# EAGLE design mega_pin_out_sides (EAGLE 7.3.0)
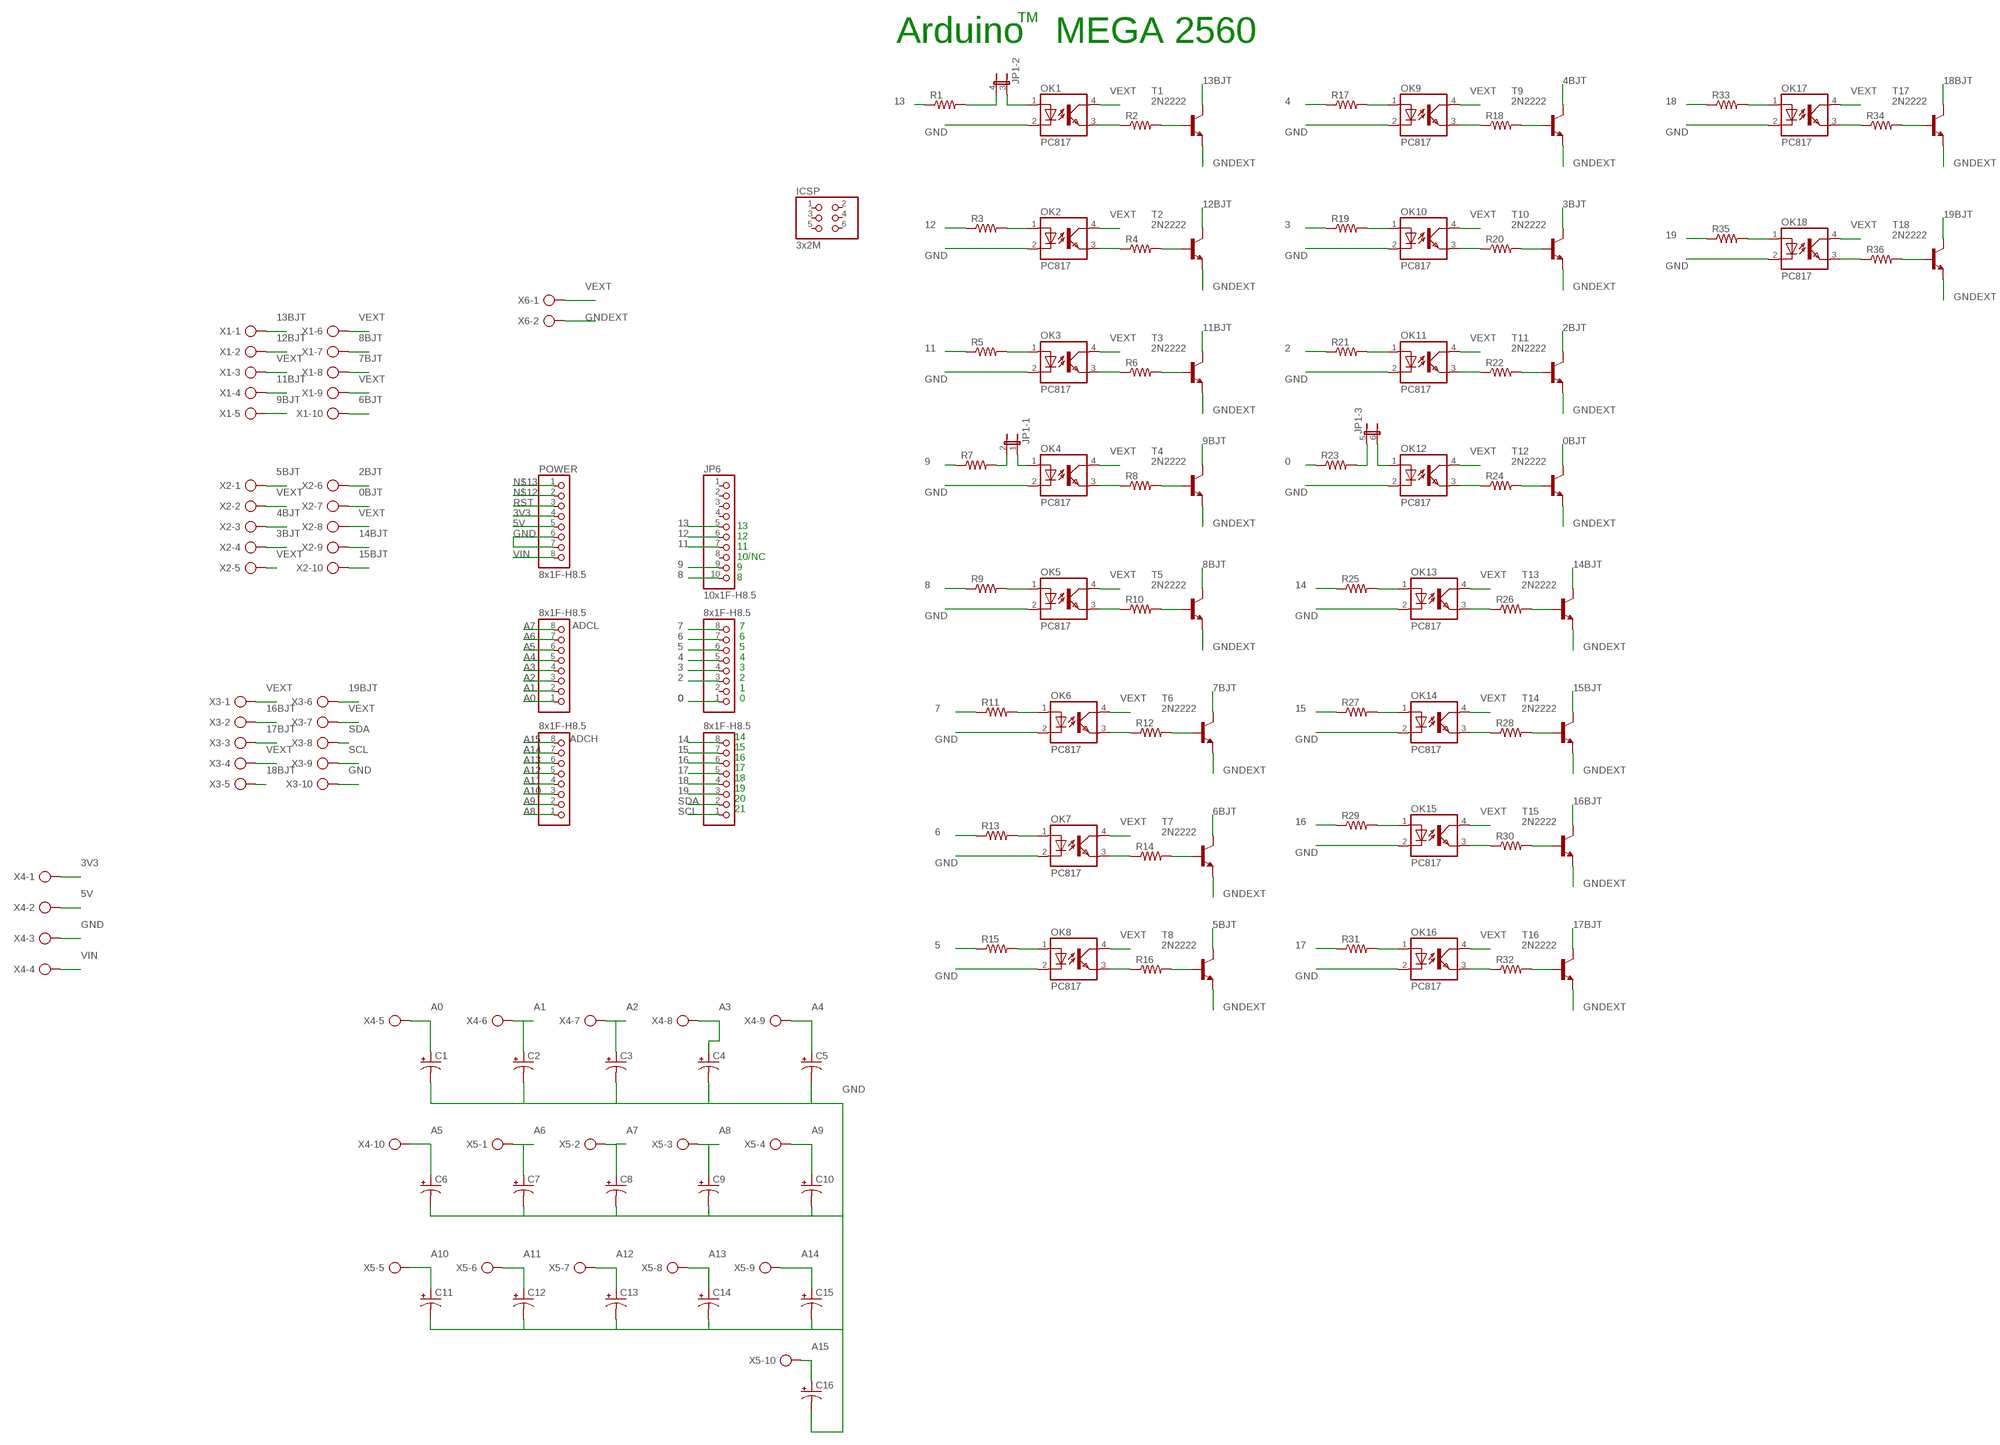
[diagram p0: schematic, sheet 1]

## Parts
ADCH  8x1F-H8.5  PINHD-1X8  [1X08]
ADCL  8x1F-H8.5  PINHD-1X8  [1X08]
C1  CPOL-USE2-4  [E2-4]
C2  CPOL-USE2-4  [E2-4]
C3  CPOL-USE2-4  [E2-4]
C4  CPOL-USE2-4  [E2-4]
C5  CPOL-USE2-4  [E2-4]
C6  CPOL-USE2-4  [E2-4]
C7  CPOL-USE2-4  [E2-4]
C8  CPOL-USE2-4  [E2-4]
C9  CPOL-USE2-4  [E2-4]
C10  CPOL-USE2-4  [E2-4]
C11  CPOL-USE2-4  [E2-4]
C12  CPOL-USE2-4  [E2-4]
C13  CPOL-USE2-4  [E2-4]
C14  CPOL-USE2-4  [E2-4]
C15  CPOL-USE2-4  [E2-4]
C16  CPOL-USE2-4  [E2-4]
COMMUNICATION  8x1F-H8.5  PINHD-1X8  [1X08]
ICSP  3x2M  PINHD-2X3  [2X03]
JP1  JP3QE  [JP3Q]
JP6  10x1F-H8.5  PINHD-1X10_ARD  [1X10]
OK1  PC817  [DIL04]
OK2  PC817  [DIL04]
OK3  PC817  [DIL04]
OK4  PC817  [DIL04]
OK5  PC817  [DIL04]
OK6  PC817  [DIL04]
OK7  PC817  [DIL04]
OK8  PC817  [DIL04]
OK9  PC817  [DIL04]
OK10  PC817  [DIL04]
OK11  PC817  [DIL04]
OK12  PC817  [DIL04]
OK13  PC817  [DIL04]
OK14  PC817  [DIL04]
OK15  PC817  [DIL04]
OK16  PC817  [DIL04]
OK17  PC817  [DIL04]
OK18  PC817  [DIL04]
POWER  8x1F-H8.5  PINHD-1X8  [1X08]
PWML  8x1F-H8.5  PINHD-1X8  [1X08]
R1  R-US_M1206  [M1206]
R2  R-US_M1206  [M1206]
R3  R-US_M1206  [M1206]
R4  R-US_M1206  [M1206]
R5  R-US_M1206  [M1206]
R6  R-US_M1206  [M1206]
R7  R-US_M1206  [M1206]
R8  R-US_M1206  [M1206]
R9  R-US_M1206  [M1206]
R10  R-US_M1206  [M1206]
R11  R-US_M1206  [M1206]
R12  R-US_M1206  [M1206]
R13  R-US_M1206  [M1206]
R14  R-US_M1206  [M1206]
R15  R-US_M1206  [M1206]
R16  R-US_M1206  [M1206]
R17  R-US_M1206  [M1206]
R18  R-US_M1206  [M1206]
R19  R-US_M1206  [M1206]
R20  R-US_M1206  [M1206]
R21  R-US_M1206  [M1206]
R22  R-US_M1206  [M1206]
R23  R-US_M1206  [M1206]
R24  R-US_M1206  [M1206]
R25  R-US_M1206  [M1206]
R26  R-US_M1206  [M1206]
R27  R-US_M1206  [M1206]
R28  R-US_M1206  [M1206]
R29  R-US_M1206  [M1206]
R30  R-US_M1206  [M1206]
R31  R-US_M1206  [M1206]
R32  R-US_M1206  [M1206]
R33  R-US_M1206  [M1206]
R34  R-US_M1206  [M1206]
R35  R-US_M1206  [M1206]
R36  R-US_M1206  [M1206]
T1  2N2222  [TO18]
T2  2N2222  [TO18]
T3  2N2222  [TO18]
T4  2N2222  [TO18]
T5  2N2222  [TO18]
T6  2N2222  [TO18]
T7  2N2222  [TO18]
T8  2N2222  [TO18]
T9  2N2222  [TO18]
T10  2N2222  [TO18]
T11  2N2222  [TO18]
T12  2N2222  [TO18]
T13  2N2222  [TO18]
T14  2N2222  [TO18]
T15  2N2222  [TO18]
T16  2N2222  [TO18]
T17  2N2222  [TO18]
T18  2N2222  [TO18]
X1  AK500/10  [AK500/10]
X2  AK500/10  [AK500/10]
X3  AK500/10  [AK500/10]
X4  AK500/10  [AK500/10]
X5  AK500/10  [AK500/10]
X6  AK500/2  [AK500/2]

## Nets
0: PWML.1 R23.1
0BJT: T12.3(C) X2.7
2: PWML.3 R21.1
2BJT: T11.3(C) X2.6
3: PWML.4 R19.1
3BJT: T10.3(C) X2.4
3V3: POWER.4 X4.1
4: PWML.5 R17.1
4BJT: T9.3(C) X2.3
5: PWML.6 R15.1
5BJT: T8.3(C) X2.1
5V: POWER.5 X4.2
6: PWML.7 R13.1
6BJT: T7.3(C) X1.10
7: PWML.8 R11.1
7BJT: T6.3(C) X1.8
8: JP6.10 R9.1
8BJT: T5.3(C) X1.7
9: JP6.9 R7.1
9BJT: T4.3(C) X1.5
11: JP6.7 R5.1
11BJT: T3.3(C) X1.4
12: JP6.6 R3.1
12BJT: T2.3(C) X1.2
13: JP6.5 R1.1
13BJT: T1.3(C) X1.1
14: COMMUNICATION.8 R25.1
14BJT: T13.3(C) X2.9
15: COMMUNICATION.7 R27.1
15BJT: T14.3(C) X2.10
16: COMMUNICATION.6 R29.1
16BJT: T15.3(C) X3.2
17: COMMUNICATION.5 R31.1
17BJT: T16.3(C) X3.3
18: COMMUNICATION.4 R33.1
18BJT: T17.3(C) X3.5
19: COMMUNICATION.3 R35.1
19BJT: T18.3(C) X3.6
A0: ADCL.1 C1.+ X4.5
A1: ADCL.2 C2.+ X4.6
A2: ADCL.3 C3.+ X4.7
A3: ADCL.4 C4.+ X4.8
A4: ADCL.5 C5.+ X4.9
A5: ADCL.6 C6.+ X4.10
A6: ADCL.7 C7.+ X5.1
A7: ADCL.8 C8.+ X5.2
A8: ADCH.1 C9.+ X5.3
A9: ADCH.2 C10.+ X5.4
A10: ADCH.3 C11.+ X5.5
A11: ADCH.4 C12.+ X5.6
A12: ADCH.5 C13.+ X5.7
A13: ADCH.6 C14.+ X5.8
A14: ADCH.7 C15.+ X5.9
A15: ADCH.8 C16.+ X5.10
GND: C1.- C2.- C3.- C4.- C5.- C6.- C7.- C8.- C9.- C10.- C11.- C12.- C13.- C14.- C15.- C16.- OK1.2(C) OK2.2(C) OK3.2(C) OK4.2(C) OK5.2(C) OK6.2(C) OK7.2(C) OK8.2(C) OK9.2(C) OK10.2(C) OK11.2(C) OK12.2(C) OK13.2(C) OK14.2(C) OK15.2(C) OK16.2(C) OK17.2(C) OK18.2(C) POWER.6 POWER.7 X3.10 X4.3
GNDEXT: T1.1(E) T2.1(E) T3.1(E) T4.1(E) T5.1(E) T6.1(E) T7.1(E) T8.1(E) T9.1(E) T10.1(E) T11.1(E) T12.1(E) T13.1(E) T14.1(E) T15.1(E) T16.1(E) T17.1(E) T18.1(E) X6.2
N$1: JP1.4 R1.2
N$2: OK1.3(EMIT) R2.1
N$4: R2.2 T1.2(B)
N$5: OK2.1(A) R3.2
N$6: OK2.3(EMIT) R4.1
N$7: R4.2 T2.2(B)
N$8: OK3.1(A) R5.2
N$9: JP1.3 OK1.1(A)
N$10: JP1.6 OK12.1(A)
N$11: JP1.1 OK4.1(A)
N$12: POWER.2
N$13: POWER.1
N$14: OK5.1(A) R9.2
N$15: OK5.3(EMIT) R10.1
N$17: OK3.3(EMIT) R6.1
N$18: R6.2 T3.2(B)
N$19: JP1.2 R7.2
N$20: OK4.3(EMIT) R8.1
N$21: R8.2 T4.2(B)
N$22: R10.2 T5.2(B)
N$23: OK6.1(A) R11.2
N$24: OK6.3(EMIT) R12.1
N$25: R12.2 T6.2(B)
N$26: OK7.1(A) R13.2
N$27: OK7.3(EMIT) R14.1
N$28: R14.2 T7.2(B)
N$29: OK8.1(A) R15.2
N$30: OK8.3(EMIT) R16.1
N$31: R16.2 T8.2(B)
N$32: OK9.1(A) R17.2
N$33: OK9.3(EMIT) R18.1
N$34: R18.2 T9.2(B)
N$35: OK10.1(A) R19.2
N$36: OK10.3(EMIT) R20.1
N$37: R20.2 T10.2(B)
N$38: OK11.1(A) R21.2
N$39: OK11.3(EMIT) R22.1
N$40: R22.2 T11.2(B)
N$41: OK16.1(A) R31.2
N$42: OK16.3(EMIT) R32.1
N$43: R32.2 T16.2(B)
N$44: JP1.5 R23.2
N$45: OK12.3(EMIT) R24.1
N$46: R24.2 T12.2(B)
N$47: OK13.1(A) R25.2
N$48: OK13.3(EMIT) R26.1
N$49: R26.2 T13.2(B)
N$50: OK14.1(A) R27.2
N$51: OK14.3(EMIT) R28.1
N$52: R28.2 T14.2(B)
N$53: OK15.1(A) R29.2
N$54: OK15.3(EMIT) R30.1
N$55: R30.2 T15.2(B)
N$56: OK18.1(A) R35.2
N$57: OK18.3(EMIT) R36.1
N$58: R36.2 T18.2(B)
N$59: OK17.1(A) R33.2
N$60: OK17.3(EMIT) R34.1
N$61: R34.2 T17.2(B)
RST: POWER.3
SCL: COMMUNICATION.1 X3.9
SDA: COMMUNICATION.2 X3.8
VEXT: OK1.4(COL) OK2.4(COL) OK3.4(COL) OK4.4(COL) OK5.4(COL) OK6.4(COL) OK7.4(COL) OK8.4(COL) OK9.4(COL) OK10.4(COL) OK11.4(COL) OK12.4(COL) OK13.4(COL) OK14.4(COL) OK15.4(COL) OK16.4(COL) OK17.4(COL) OK18.4(COL) X1.3 X1.6 X1.9 X2.2 X2.5 X2.8 X3.1 X3.4 X3.7 X6.1
VIN: POWER.8 X4.4
Unconnected: ICSP.1 ICSP.2 ICSP.3 ICSP.4 ICSP.5 ICSP.6 JP6.1 JP6.2 JP6.3 JP6.4 JP6.8 PWML.2

## Notes on the sheet
- TM
- Arduino   MEGA 2560
- 13
- 12
- 11
- 10/NC
- 9
- 8
- 7
- 6
- 5
- 4
- 3
- 2
- 1
- 0
- 14
- 15
- 16
- 17
- 18
- 19
- 20
- 21

## Library data of the parts
ADCH ADCL COMMUNICATION POWER PWML = SmartPrj:PINHD-1X8: PIN HEADER
C1-C16 = adafruit:CPOL-US: POLARIZED CAPACITOR, American symbol
ICSP = SmartPrj:PINHD-2X3: PIN HEADER
JP1 = jumper:JP3QE: JUMPER
JP6 = SmartPrj:PINHD-1X10_ARD: PIN HEADER
OK1-OK18 = optocoupler:PC817: SHARP OPTO COUPLER; MPN: PC817X4J000F; OC_FARNELL: 9707727; OC_NEWARK: 97K7059
R1-R36 = resistor:R-US_: RESISTOR, American symbol
T1-T18 = transistor:2N2222: NPN TRANSISTOR
X1-X5 = con-ptr500:AK500/10: CONNECTOR; OC_FARNELL: unknown; OC_NEWARK: unknown
X6 = con-ptr500:AK500/2: CONNECTOR; OC_FARNELL: unknown; OC_NEWARK: unknown

## Net classes
0 default: width 0.203 mm, drill 0.406 mm, clearance 0.203 mm
1 power: width 0.61 mm, drill 0.406 mm, clearance 0.203 mm
2 gnd: width 0.305 mm, drill 0.406 mm, clearance 0.203 mm
3 power usb: width 0.508 mm, drill 0.406 mm, clearance 0.203 mm

## Board
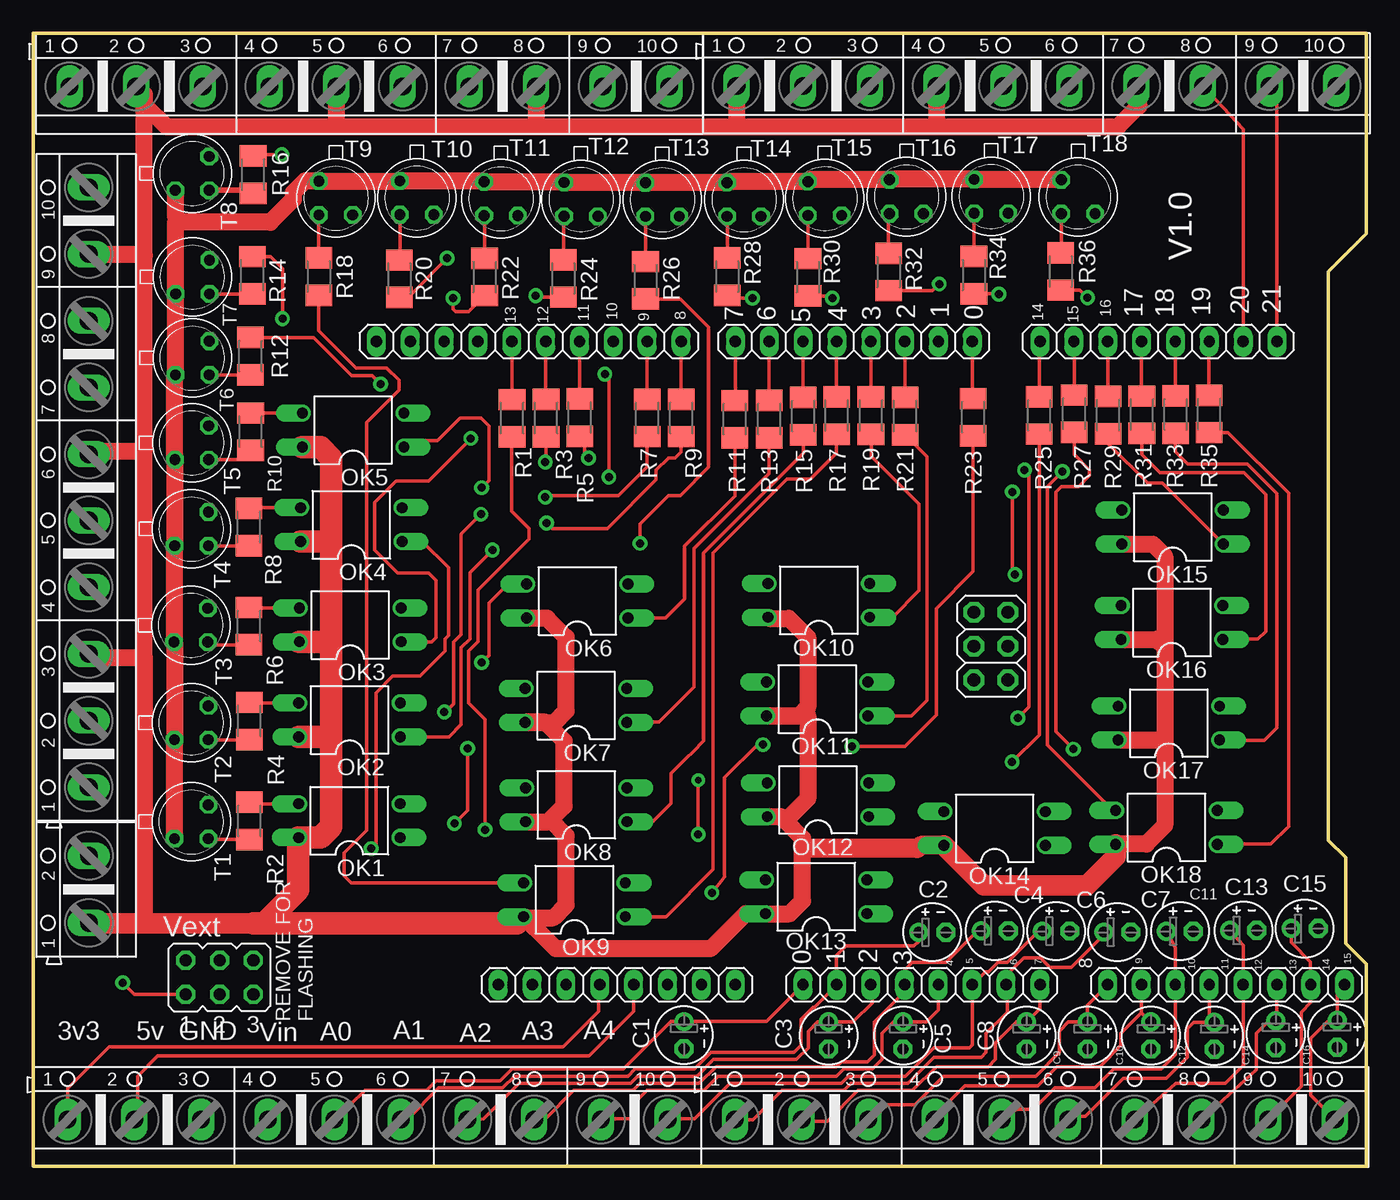
[diagram p1: board, top side]
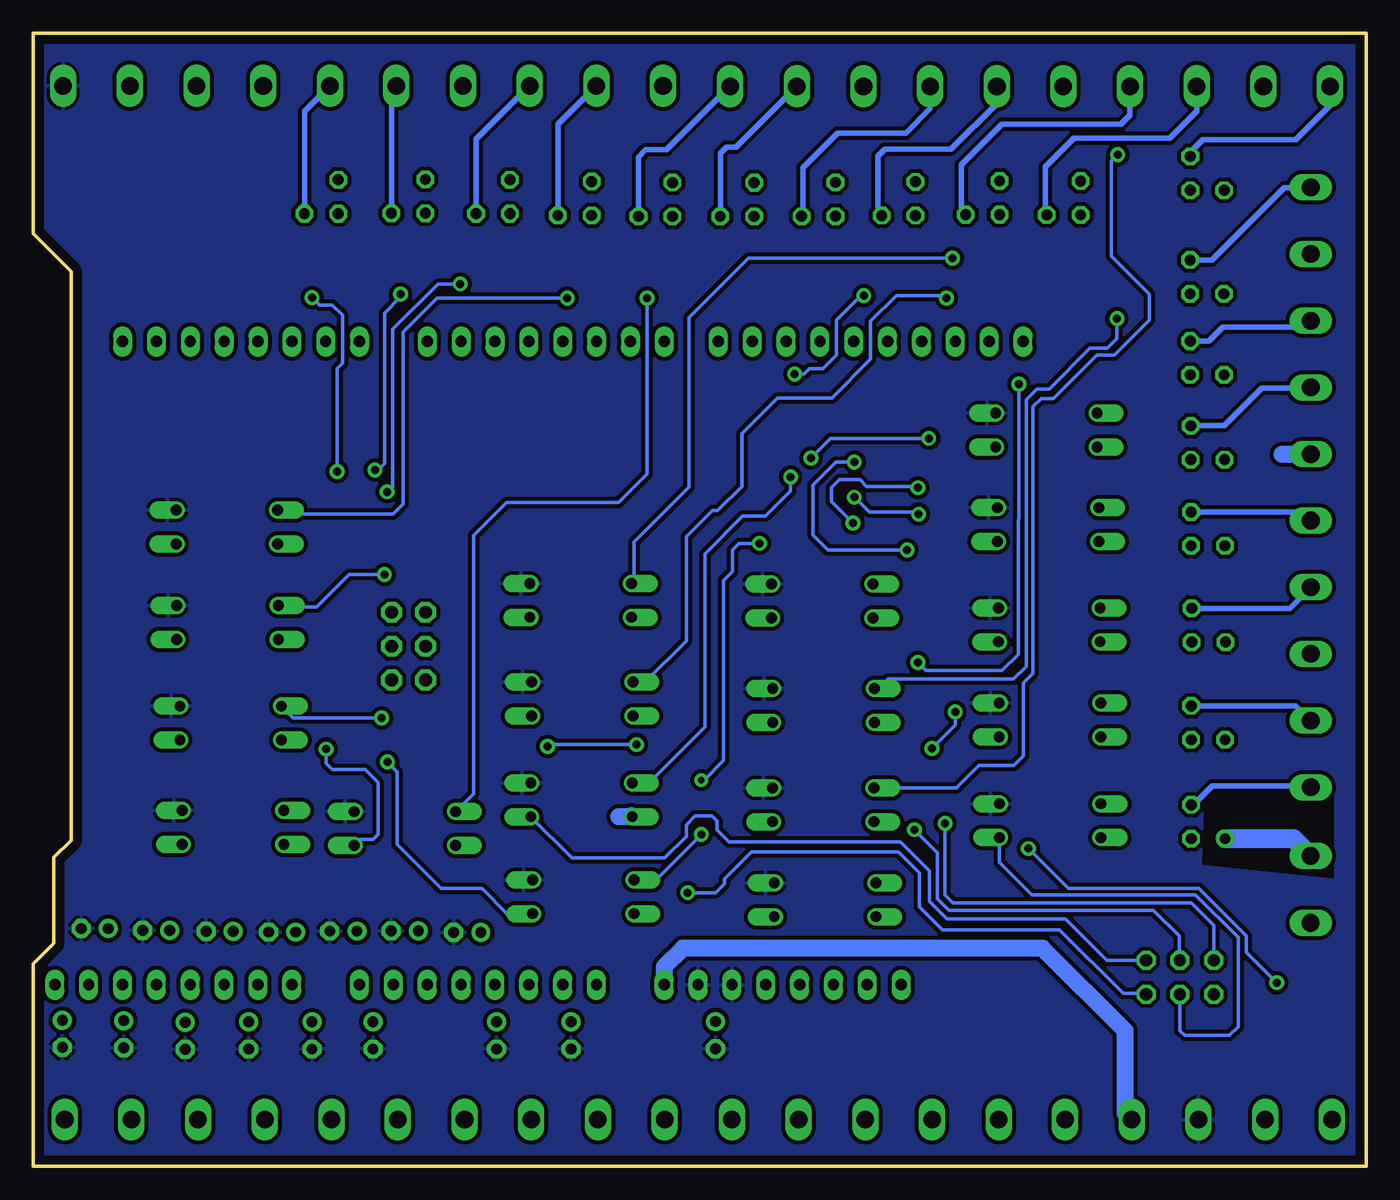
[diagram p2: board, bottom side, seen from below]

Size 100 x 85 mm. Coordinates in mm from the lower left corner, seen from the top.
Outline: 100,0 0,0 0,85 100,85 100,69.95 97.17,67.12 97.17,24.46 98.45,23.18 98.45,16.72 100,15.17 100,0
Copper layers (1*16): Top 0.035mm / dielectric 1.5mm / Bottom 0.035mm
Design rules "default": minimum track width 8mil, minimum drill 16mil, track to track 7mil, track to pad 7mil, pad to pad 8mil, via to via 10mil, smd to smd 7mil, copper to edge 27mil, drill to drill 12mil, minimum pad ring 10mil, minimum via ring 10mil, stop-mask expansion 2mil, vias tented up to drill 24mil, thermal gap 10mil

### Footprints (pad centres in the part's own frame; a part is rotated, then mirrored left to right if it is on the bottom)
1X08 = drill 0.85 pad 1.422 long: 1 -8.89,0; 2 -6.35,0; 3 -3.81,0; 4 -1.27,0; 5 1.27,0; 6 3.81,0; 7 6.35,0; 8 8.89,0
E2-4 = drill 0.813 pad 1.422: + -1.016,0 | drill 0.813 pad 1.422 octagon: - 1.016,0
2X03 = drill 0.95 pad 1.55 octagon: 1 -2.54,-1.27; 2 -2.54,1.27; 3 0,-1.27; 4 0,1.27; 5 2.54,-1.27; 6 2.54,1.27
JP3Q = drill 0.914 octagon: 1 -2.54,-1.27; 2 -2.54,1.27; 3 0,-1.27; 4 0,1.27; 5 2.54,-1.27; 6 2.54,1.27
1X10 = drill 0.85 pad 1.422 long: 1 -11.43,0; 2 -8.89,0; 3 -6.35,0; 4 -3.81,0; 5 -1.27,0; 6 1.27,0; 7 3.81,0; 8 6.35,0; 9 8.89,0; 10 11.43,0
DIL04 = drill 0.813 offset: 1 -1.27,-3.81; 2 1.27,-3.81; 3 1.27,3.81; 4 -1.27,3.81
M1206 = smd 1.6 x 2: 1 -1.4,0; 2 1.4,0
TO18 = drill 0.813 octagon: 1 -1.27,-1.27; 2 1.27,-1.27; 3 1.27,1.27
AK500/10 = drill 1.321 long: 1 -22.504,0; 2 -17.501,0; 3 -12.497,0; 4 -7.493,0; 5 -2.489,0; 6 2.489,0; 7 7.493,0; 8 12.497,0; 9 17.501,0; 10 22.504,0
AK500/2 = drill 1.321 long: 1 -2.515,0; 2 2.515,0

### Placement (x,y rotation side)
ADCH  89.5,13.62 0 top
ADCL  66.64,13.62 0 top
C1  48.81,9.83 270 top
C2  67.44,17.55 0 top
C3  59.66,9.8 270 top
C4  72.13,17.65 0 top
C5  65.25,9.8 270 top
C6  76.74,17.64 0 top
C7  81.33,17.56 0 top
C8  74.52,9.8 270 top
C9  79.1,9.8 270 top
C10  83.85,9.8 270 top
C11  86.03,17.62 0 top
C12  88.6,9.78 270 top
C13  90.79,17.68 0 top
C14  93.22,9.91 270 top
C15  95.39,17.83 0 top
C16  97.82,9.93 270 top
COMMUNICATION  84.42,61.88 180 top
ICSP  71.84,39.02 270 top
JP1  13.97,14.17 0 top
JP6  37.17,61.88 0 top
OK1  23.7,25.93 90 top
OK2  23.72,33.49 90 top
OK3  23.77,40.62 90 top
OK4  23.86,48.13 90 top
OK5  23.99,55.23 90 top
OK6  40.81,42.41 90 top
OK7  40.72,34.57 90 top
OK8  40.74,27.12 90 top
OK9  40.6,20 90 top
OK10  58.94,42.45 90 top
OK11  58.82,35.06 90 top
OK12  58.87,27.49 90 top
OK13  58.73,20.22 90 top
OK14  72.13,25.34 90 top
OK15  85.48,47.95 90 top
OK16  85.43,40.8 90 top
OK17  85.19,33.25 90 top
OK18  85.02,25.43 90 top
POWER  43.78,13.62 0 top
PWML  61.56,61.88 180 top
R1  35.92,56.12 270 top
R2  16.21,25.9 270 top
R3  38.47,56.14 270 top
R4  16.2,33.39 270 top
R5  40.99,56.17 270 top
R6  16.18,40.52 270 top
R7  46.05,56.14 270 top
R8  16.16,47.95 270 top
R9  48.61,56.14 270 top
R10  16.31,55.1 270 top
R11  52.63,56.04 270 top
R12  16.3,60.78 270 top
R13  55.21,56.05 270 top
R14  16.43,66.84 270 top
R15  57.77,56.28 270 top
R16  16.5,74.4 270 top
R17  60.27,56.31 270 top
R18  21.42,66.75 90 top
R19  62.85,56.32 270 top
R20  27.46,66.59 90 top
R21  65.4,56.28 270 top
R22  33.85,66.72 90 top
R23  70.52,56.2 270 top
R24  39.76,66.61 90 top
R25  75.47,56.34 270 top
R26  45.94,66.47 90 top
R27  78.09,56.45 270 top
R28  52.07,66.74 90 top
R29  80.64,56.36 270 top
R30  58.12,66.69 90 top
R31  83.17,56.38 270 top
R32  64.17,67.09 90 top
R33  85.7,56.4 270 top
R34  70.57,66.86 90 top
R35  88.21,56.45 270 top
R36  77.08,67.14 90 top
T1  11.86,25.84 0 top
T2  11.86,33.27 0 top
T3  11.82,40.59 0 top
T4  11.87,47.81 0 top
T5  11.89,54.28 0 top
T6  11.94,60.64 0 top
T7  11.94,66.72 0 top
T8  11.92,74.49 0 top
T9  22.7,72.64 270 top
T10  28.77,72.66 270 top
T11  35.09,72.59 270 top
T12  41.09,72.54 270 top
T13  47.19,72.53 270 top
T14  53.32,72.53 270 top
T15  59.38,72.61 270 top
T16  65.51,72.74 270 top
T17  71.86,72.77 270 top
T18  78.39,72.74 270 top
X1  4.16,50.94 90 top
X2  25.22,81.03 0 top
X3  75.26,81.06 0 top
X4  25.08,3.5 0 top
X5  75.14,3.5 0 top
X6  4.16,20.77 90 top

### Tracks (layer width: path | path; a pad name or v marks a point on that pad's centre or on a via)
0
  Top 0.254: PWML.1 70.45,57.66 R23.1
0BJT
  Bottom 0.406: T12.3 42.27,71.36 42.27,74.93 39.67,77.52 34.54,77.52 32.71,79.35 X2.7
2
  Top 0.254: R21.1 65.4,61.84 PWML.3
2BJT
  Bottom 0.406: T11.3 36.63,71.59 36.63,75.79 36.12,76.3 31.14,76.3 27.71,79.73 X2.6
3
  Top 0.254: PWML.4 62.83,57.74 R19.1
3BJT
  Bottom 0.406: T10.3 30.38,71.72 30.38,75.13 27.33,78.18 18.39,78.18 17.73,78.84 X2.4
3V3
  Top 0.254: POWER.4 42.42,13.53 42.42,11.63 39.73,8.94 5.69,8.94 2.58,5.83 X4.1
4
  Top 0.254: R17.1 60.27,61.86 PWML.5
4BJT
  Bottom 0.406: T9.3 24.08,71.48 24.08,74.98 21.95,77.11 14.73,77.11 12.7,79.15 12.7,81 X2.3
5
  Top 0.254: PWML.6 57.75,57.7 R15.1
5BJT
  Bottom 0.406: X2.1 2.72,79.58 5.28,77.01 12.24,77.01 13.19,76.06 T8.3
5V
  Top 0.254: X4.2 7.82,3.74 7.82,6.76 9.35,8.28 41.71,8.28 45.05,11.62 POWER.5
6
  Top 0.254: R13.1 PWML.7
6BJT
  Bottom 0.406: T7.3 11.56,67.99 6.15,73.41 4.19,73.41 X1.10
7
  Top 0.254: PWML.8 52.67,57.48 R11.1
7BJT
  Bottom 0.406: T6.3 11.8,61.91 10.77,62.94 4.65,62.94 X1.8
8
  Top 0.254: R9.1 48.61,61.87 JP6.10
8BJT
  Bottom 0.406: T5.3 10.64,55.55 7.82,58.37 4.22,58.37 X1.7
9
  Top 0.254: JP6.9 46.06,57.55 R7.1
9BJT
  Bottom 0.254: 4.79,49.09 X1.5
  Bottom 0.406: T4.3 4.79,49.09
11
  Top 0.254: R5.1 40.99,61.87 JP6.7
11BJT
  Bottom 0.406: T3.3 5.74,41.86 X1.4
12
  Top 0.254: JP6.6 38.44,57.57 R3.1
12BJT
  Bottom 0.406: T2.3 5.26,34.54 X1.2
13
  Top 0.254: R1.1 35.92,61.86 JP6.5
13BJT
  Bottom 0.406: X1.1 4.27,28.55 11.53,28.55 12.97,27.11 T1.3
14
  Top 0.254: R25.1 75.47,61.82 COMMUNICATION.8
14BJT
  Bottom 0.406: T13.3 48.46,76 48.01,76.45 47.29,76.45 X2.9
15
  Top 0.254: R27.1 78.09,61.85 COMMUNICATION.7
15BJT
  Bottom 0.406: T14.3 54.59,75.71 54.05,76.25 52.5,76.25 X2.10
16
  Top 0.254: COMMUNICATION.6 80.61,57.79 R29.1
16BJT
  Bottom 0.406: T15.3 60.65,78.17 X3.2
17
  Top 0.254: COMMUNICATION.5 83.15,57.81 R31.1
17BJT
  Bottom 0.406: T16.3 66.78,77.04 X3.3
18
  Top 0.254: R33.1 85.7,61.86 COMMUNICATION.4
18BJT
  Bottom 0.406: T17.3 73.13,80.7 X3.5
19
  Top 0.254: R35.1 88.21,61.86 COMMUNICATION.3
19BJT
  Bottom 0.406: T18.3 79.66,79.15 X3.6
A0
  Top 0.254: ADCL.1 55.02,10.85 C1.+ 47.83,10.85 44.27,7.29 35.92,7.29 35.03,6.4 30.23,6.4 29.52,5.69 24.89,5.69 X4.5
A1
  Top 0.254: X4.6 28.1,3.57 30.4,5.87 35.2,5.87 36.09,6.76 44.63,6.76 45.16,7.29 49.61,7.29 50.85,8.53 57.07,8.53 57.61,9.07 57.61,11.02 58.5,11.91 58.62,11.91 ADCL.2 60.27,13.59 60.27,15.82 60.98,16.54 60.99,16.53 66.08,16.53 66.42,16.88 C2.+
A2
  Top 0.254: ADCL.3 62.94,13.46 62.94,12.27 61.49,10.82 C3.+ 58.83,10.82 58.14,10.13 58.14,8.89 57.25,8 51.03,8 49.78,6.76 45.34,6.76 44.81,6.22 36.45,6.22 33.79,3.57 X4.7
A3
  Top 0.254: X4.8 38.42,3.57 40.54,5.69 44.98,5.69 45.52,6.22 49.96,6.22 51.21,7.47 60.27,7.47 60.63,7.82 62.59,7.82 63.12,8.36 63.12,10.85 65.25,12.98 65.25,13.46 ADCL.4 65.25,13.69 65.25,14.58 65.96,15.29 68.45,15.29 70.82,17.65 C4.+
A4
  Top 0.254: ADCL.5 67.92,13.56 67.92,11.73 67,10.82 C5.+ 64.52,10.82 63.65,9.96 63.65,8 62.94,7.29 60.81,7.29 60.27,6.76 51.38,6.76 50.32,5.69 46.05,5.69 45.16,4.8 45.16,3.91 44.81,3.56 42.77,3.56 X4.9
A5
  Top 0.254: X4.10 47.77,3.56 49.61,3.56 52.27,6.22 60.63,6.22 61.16,6.76 65.43,6.76 67.56,8.89 70.23,8.89 70.45,9.11 ADCL.6 71.45,14.58 71.65,14.58 72.36,15.29 73.08,15.29 75.42,17.64 C6.+
A6
  Top 0.254: X5.1 53.99,3.5 56.19,5.69 60.81,5.69 61.34,6.22 65.61,6.22 67.56,8.18 71.12,8.18 71.48,8.53 71.48,9.96 73.08,11.56 73.08,13.49 ADCL.7 72.9,13.66 72.9,14.22 74.32,15.65 75.56,15.65 76.28,14.94 77.88,14.94 80.31,17.37 C7.+
A7
  Top 0.254: ADCL.8 75.53,11.82 C8.+ 73.76,10.82 72.19,9.25 72.19,8 71.65,7.47 67.74,7.47 65.96,5.69 61.87,5.69 59.56,3.38 58.11,3.38 X5.2
A8
  Top 0.254: ADCH.1 79.1,12.07 C9.+ 77.67,10.82 76.99,10.13 76.99,8.53 75.21,6.76 68.28,6.76 66.14,4.62 64.12,4.62 X5.3
A9
  Top 0.254: ADCH.2 83.15,11.52 | 83.15,11.52 C10.+ | X5.4 68,4.17 69.88,6.04 75.39,6.04 76.81,7.47 80.01,7.47 81.61,9.07 81.61,9.98 83.15,11.52
A10
  Top 0.254: C11.+ 85.69,16.42 ADCH.3 85.69,8.34 84.63,7.29 81.08,7.29 79.65,5.87 76.63,5.87 75.03,4.27 73.78,4.27 X5.5
A11
  Top 0.254: ADCH.4 88.23,11.16 C12.+ 87.07,10.79 86.59,10.31 86.59,8.18 84.99,6.58 81.79,6.58 78.94,3.73 78.22,3.73 X5.6
A12
  Top 0.254: C13.+ 90.77,16.57 ADCH.5 90.77,7.63 90.81,7.59 89.43,6.22 85.72,6.22 X5.7
A13
  Top 0.254: ADCH.6 93.31,11.01 C14.+ 92.71,10.92 91.75,9.96 91.75,7.25 X5.8
A14
  Top 0.254: X5.9 95.12,5.98 95.12,11.56 95.85,12.28 ADCH.7 95.82,13.64 95.82,15.34 94.37,16.79 C15.+
A15
  Top 0.254: ADCH.8 97.81,13.01 C16.+ 97.71,10.85 97.08,10.85 95.83,9.6 95.83,5.31 X5.10
GND
  pour Bottom (isolate 0.305): 0.3,84.63 99.67,84.63 99.67,0.41 0.3,0.41
GNDEXT
  Top 0.813: 10.59,39.28 T3.1 | 10.55,47 10.52,47.04 10.52,46.62 T4.1
  Top 1.27: T3.1 10.6,39.37 T4.1 10.6,52.98 T5.1 10.62,59.33 T6.1 T7.1 10.67,70.82 10.9,71.04 | 10.59,39.28 T2.1 T1.1 | T18.1 70.62,74.01 T17.1 64.27,74.04 T16.1 58.24,74.01 T15.1 52.13,73.88 T14.1 T13.1 39.83,73.8 T12.1 39.77,73.86 T11.1 33.75,73.93 T10.1 27.49,73.91 T9.1 20.37,73.91 19.51,73.05 19.51,72.54 17.78,70.81 11.12,70.81 10.9,71.04 | 10.9,71.04 10.67,71.27 10.67,73.2 T8.1
  Bottom 0.813: 10.62,59.33 T6.1
  Bottom 1.422: X6.2 5.45,24.57 T1.1
N$1  (via drill 0.6)
  Top 0.254: R1.2 35.87,54.67 35.87,49.17 37.19,47.85 37.19,47.04 33.38,43.23 33.38,39.39 32.66,38.67 32.66,38.16 32.66,38.15 32.66,34.75 33.88,33.53 v33.88,25.25
  Bottom 0.254: v33.88,25.25 32.16,23.52 32.16,20.07 31.29,19.2 15.95,19.2 14.02,17.27 14.02,15.49 JP1.4
N$2
  Top 0.254: OK1.3 16.32,27.2 R2.1
N$4
  Top 0.254: R2.2 13.2,24.5 T1.2
N$5  (via drill 0.6 pad 0.81)
  Top 0.254: R3.2 38.47,52.9 v38.41,52.83 | OK2.1 27.54,32.21 30.28,32.21 31.19,32.21 32.11,33.13 32.11,38.91 32.77,39.57 32.77,44.55 v34.44,46.23
  Bottom 0.254: 38.3,52.83 v38.41,52.83 39.77,52.83 41.51,51.09 41.51,47.36 40.38,46.23 39.52,46.23 v34.44,46.23
N$6
  Top 0.254: OK2.3 16.23,34.76 R4.1
N$7
  Top 0.254: R4.2 13.14,31.99 T2.2
N$8  (via drill 0.6, 0.6 pad 0.81)
  Top 0.254: OK3.1 29.9,39.34 30.23,39.67 30.23,43.94 29.67,44.5 27.33,44.5 25.6,46.23 25.6,49.78 27.23,51.41 29.67,51.41 32.82,54.56 v32.82,54.61 | R5.2 41.35,54.41 41.35,53.44 v41.66,53.14
  Bottom 0.254: v32.82,54.61 40.18,54.61 v41.66,53.14
N$9
  Bottom 0.254: JP1.3 13.97,10.16 13.61,9.8 10.26,9.8 9.6,10.46 9.6,17.17 12.8,20.37 25.09,20.37 27.52,22.79 OK1.1
N$10
  Bottom 0.254: JP1.6 19.46,15.44 22.55,18.54 31.45,18.54 32.77,19.86 32.77,22.15 34.95,24.33 47.8,24.33 48.72,25.25 48.72,25.91 49.07,26.26 50.34,26.26 51,25.6 51,24.74 52.63,23.11 59.57,23.11 OK12.1
N$11  (via drill 0.6)
  Top 0.254: OK4.1 29.19,46.86 31.14,44.91 31.14,39.83 30.89,39.57 30.89,38.66 29.01,36.78 26.98,36.78 25.7,35.51 25.7,24.18 v25.35,23.82 | v6.71,13.77 7.57,12.9 JP1.1
  Bottom 0.254: v6.71,13.77 8.99,16.05 8.99,17.27 12.55,20.83 22.35,20.83 v25.35,23.82
N$14  (via drill 0.6 pad 0.81)
  Top 0.254: R9.2 48.61,53.59 48.16,53.14 47.65,53.14 46.74,52.22 46.74,51.51 43.08,47.85 38.91,47.85 v38.51,48.26 | OK5.1 28.3,54.46 30.33,54.46 32,56.13 33.58,56.13 34.19,55.52 34.19,51.46 v33.63,50.9
  Bottom 0.254: v38.51,48.26 40.13,49.89 40.13,50.9 39.52,51.51 38,51.51 37.49,51 33.73,51 v33.63,50.9
N$15
  Top 0.254: OK5.3 R10.1
N$17
  Top 0.254: OK3.3 16.21,41.88 R6.1
N$18
  Top 0.254: R6.2 13.29,39.12 T3.2
  Bottom 0.254: 13.12,39.29 T3.2
N$19  (via drill 0.6, 0.6 pad 0.81)
  Top 0.254: R7.2 46.05,52.46 43.92,50.32 38.53,50.32 v38.41,50.19 | v33.58,48.92 32.11,47.45 32.11,39.88 31.55,39.32 31.55,34.7 30.94,34.09 v30.84,34.09 | v31.59,25.71 32.59,26.71 v32.59,31.34
  Bottom 0.254: v38.41,50.19 37.29,49.07 33.73,49.07 v33.58,48.92 | JP1.2 11.43,18.09 13.11,19.76 30.99,19.76 31.59,20.37 v31.59,25.71 | v32.59,31.34 30.84,33.09 v30.84,34.09
N$20
  Top 0.254: OK4.3 16.21,49.4 R8.1
N$21
  Top 0.254: T4.2 R8.2
N$22
  Top 0.254: T5.2 15.62,53.01 R10.2
N$23
  Top 0.254: OK6.1 47.43,41.13 48.87,42.57 48.87,46.53 52.63,50.29 R11.2
N$24  (via drill 0.6, 0.6 pad 0.81)
  Top 0.254: OK6.3 35.34,43.67 35.34,43.42 34.19,42.27 34.19,38.3 33.68,37.8 v33.63,37.8 | R12.1 21.03,62.18 23.88,59.33 25.4,59.33 v26.06,58.67
  Bottom 0.254: v26.06,58.67 26.11,38.41 27.33,37.19 33.02,37.19 v33.63,37.8
N$25
  Top 0.254: T6.2 16.29,59.37 R12.2
N$26
  Top 0.254: R13.2 55.21,51.96 49.58,46.33 49.58,35.97 46.94,33.33 44.55,33.33 OK7.1
N$27  (via drill 0.6 pad 0.81)
  Top 0.254: R14.1 17.81,68.25 18.69,67.36 v18.69,63.6
  Bottom 0.254: v18.69,63.6 18.69,62.08 19.41,61.37 20.73,61.37 23.77,58.32 24.69,58.32 25.5,57.51 25.5,37.49 26.45,36.54 35.87,36.54 36.57,35.84 OK7.3 36.57,36.17
N$28
  Top 0.254: T7.2 R14.2
N$29
  Top 0.254: R15.2 57.77,53.5 50.29,46.02 50.29,31.9 49.48,31.09 49.02,30.63 47.85,29.46 47.85,27.23 46.53,25.91 44.61,25.91 OK8.1
N$30  (via drill 0.6)
  Top 0.254: v18.64,75.89 16.59,75.89 R16.1
  Bottom 0.254: OK8.3 30.75,28.39 29.06,30.07 26.42,30.07 25.7,30.79 25.7,36.27 24.99,36.98 24.99,57 24.38,57.61 23.47,57.61 20.22,60.86 18.9,60.86 16.26,63.5 16.26,65.43 19.1,68.28 19.1,75.44 v18.64,75.89
N$31
  Top 0.254: 15.97,73.53 R16.2
  Top 0.406: 15.97,73.53 15.66,73.22 T8.2
N$32
  Top 0.254: 60.1,54.91 R17.2 60.27,53.52 58.32,51.56 56.54,51.56 51,46.02 51,22.25 47.48,18.73 OK9.1
N$33
  Top 0.254: R18.1 21.42,62.71 24.23,59.89 26.52,59.89 27.43,58.98 27.43,58.23 24.99,55.79 24.99,25.2 23.32,23.52 23.32,21.79 23.84,21.27 OK9.3
N$34
  Top 0.254: R18.2 21.42,71.36 T9.2
N$35
  Top 0.254: OK10.1 64.45,41.18 66.45,43.18 66.45,49.68 62.89,53.24 62.89,54.88 R19.2
N$36  (via drill 0.6)
  Top 0.254: v31.04,68.12 28.1,65.19 R20.1
  Bottom 0.254: OK10.3 54.91,43.94 54.91,46.84 50.8,50.95 50.8,63.65 46.33,68.12 v31.04,68.12
N$37
  Top 0.254: T10.2 27.5,68.03 R20.2
N$38
  Top 0.254: OK11.1 65.9,33.79 67.06,34.95 67.06,53.23 R21.2
N$39  (via drill 0.6 pad 0.81)
  Top 0.254: v31.5,65.13 31.5,64.31 31.7,64.11 32.65,64.11 R22.1
  Bottom 0.254: v31.5,65.13 31.7,65.33 35.26,65.33 37.19,63.4 37.19,60.55 40.09,57.65 44.17,57.65 46.84,54.98 46.84,51.01 48.67,49.18 49.05,49.18 51,47.24 51,39.42 54.09,36.33 OK11.3
N$40
  Top 0.254: R22.2 33.85,71.29 T11.2
N$41
  Top 0.254: R31.2 83.17,53.4 84.51,52.06 90.81,52.06 92.46,50.41 92.46,40.13 91.87,39.54 OK16.1
N$42  (via drill 0.6 pad 0.81)
  Top 0.254: v73.46,50.6 73.46,44.6 v73.66,44.4 | R32.1 67.47,65.69 v67.97,66.19
  Bottom 0.254: v73.46,50.6 73.05,51 73.05,62.79 69.65,66.19 v67.97,66.19 | v73.66,44.4 76.3,44.4 78.74,41.96 81.51,41.96 OK16.3
N$43
  Top 0.254: R32.2 64.17,71.4 T16.2
N$44  (via drill 0.6)
  Top 0.254: R23.2 70.51,44.6 67.74,41.83 67.74,33.86 65.38,31.5 v61.42,31.5 | v50.9,20.52 51.87,21.69 51.87,29.16 54.36,31.65 54.72,31.65 v54.74,31.63
  Bottom 0.254: JP1.5 16.56,12.95 18.24,12.95 23.01,17.73 31.8,17.73 33.53,19.46 33.53,22 35.1,23.57 46.13,23.57 48.16,21.54 48.16,21.18 48.82,20.52 v50.9,20.52 | v54.74,31.63 61.29,31.63 v61.42,31.5
N$45  (via drill 0.6 pad 0.81)
  Top 0.254: R24.1 37.81,65.21 v37.69,65.33 | v43.18,51.71 43.18,59.13 v42.88,59.44
  Bottom 0.254: v37.69,65.33 37.9,65.33 39.73,63.5 39.73,60.86 40.74,59.84 41.76,59.84 42.16,59.44 v42.88,59.44 | 54.75,28.76 OK12.3 53.79,28.76 49.61,32.94 49.61,45.94 46.78,48.77 45.06,48.77 43.18,50.65 v43.18,51.71
N$46
  Top 0.254: R24.2 39.76,71.22 T12.2
N$47  (via drill 0.6)
  Top 0.254: R25.2 75.47,32.36 v73.43,30.32
  Bottom 0.254: v73.43,30.32 72.69,29.59 72.69,24.13 69.39,20.83 66.34,20.83 64.47,18.95 OK13.1
N$48  (via drill 0.5 pad 0.61, 0.6 pad 0.25, 0.6 pad 0.81)
  Top 0.254: v45.52,46.74 45.52,48.18 47.65,50.32 48.54,50.32 50.67,52.45 50.67,62.94 48.54,65.08 R26.1 | v49.89,24.89 v49.89,28.96
  Bottom 0.254: OK13.3 53.29,21.49 v49.89,24.89 | v45.52,46.74 47.04,46.74 47.55,46.23 47.55,44.6 48.21,43.94 48.21,30.43 49.68,28.96 v49.89,28.96
N$49
  Top 0.254: R26.2 45.94,71.24 T13.2
N$50  (via drill 0.6 pad 0.81)
  Top 0.254: R27.2 78.09,53.38 79.25,52.22 79.25,51.82 78.44,51 77.11,51 76.71,50.6 76.71,32.61 v78.03,31.29
  Bottom 0.254: OK14.1 75.47,24.54 74.5,24.54 74.14,24.89 74.14,28.8 75.1,29.76 77.58,29.76 78.04,30.22 v78.04,31.28 v78.03,31.29
N$51  (via drill 0.6 pad 0.81)
  Top 0.254: v53.95,65.13 52.28,65.13 R28.1
  Bottom 0.254: v53.95,65.13 53.95,51.92 56.08,49.78 64.51,49.78 66.98,47.31 66.98,27.94 OK14.3 68.43,26.49 68.81,26.49 68.63,26.67
N$52
  Top 0.254: R28.2 52.07,71.24 T14.2
N$53
  Top 0.254: R29.2 80.64,54.23 83.62,51.25 84.72,51.25 OK15.1
N$54  (via drill 0.6 pad 0.81)
  Top 0.254: R30.1 59.68,65.29 v59.94,65.13
  Bottom 0.254: v59.94,65.13 69.7,65.13 72.24,62.59 72.24,49.68 72.99,48.93 81.38,48.93 OK15.3
N$55
  Top 0.254: R30.2 58.12,71.32 T15.2
N$56
  Top 0.254: R35.2 89.64,55.05 94.18,50.5 94.18,25.51 92.84,24.17 OK18.1
N$57  (via drill 0.6 pad 0.81)
  Top 0.254: OK18.3 81,26.7 76.1,31.6 76.1,51 v77.22,52.12 | R36.1 78.54,65.73 v79.1,65.18
  Bottom 0.254: v77.22,52.12 77.22,59.84 76.81,60.25 76.81,63.86 77.57,64.62 78.54,64.62 v79.1,65.18
N$58
  Top 0.254: T18.2 77.12,68.58 R36.2
N$59
  Top 0.254: R33.2 85.7,53.62 86.62,52.7 91.07,52.7 93.29,50.48 93.29,32.89 92.34,31.94 89.04,31.94 OK17.1
N$60  (via drill 0.6 pad 0.81)
  Top 0.254: R34.1 72.41,65.46 v72.44,65.43 | v73.86,33.63 74.68,34.44 74.68,51.92 v74.37,52.22
  Bottom 0.254: v72.44,65.43 72.44,65.23 73.66,64.01 73.66,52.73 74.17,52.22 v74.37,52.22 | v73.86,33.63 80.5,33.63 OK17.3
N$61
  Top 0.254: R34.2 70.57,71.48 T17.2
N$62
  cutout Bottom: 12.2,22.72 2.54,21.69 2.54,27.89 11.99,27.94
SCL
  Top 0.254: COMMUNICATION.1 93.31,80.26 X3.9
SDA
  Top 0.254: COMMUNICATION.2 90.77,77.8 X3.8
VEXT
  Top 1.27: 56.42,25.89 57.71,24.6 57.71,24.18 57.71,19.91 56.74,18.95 OK13.4 53.44,18.95 50.8,16.31 39.22,16.31 38.71,16.82 38.7,16.82 OK9.4 | 56.42,25.89 56.09,26.22 OK12.4 | OK8.4 38.65,25.85 38.73,25.93 | 38.73,25.93 39.83,27.03 39.83,31.9 38.41,33.33 36.93,33.33 OK7.4 39.09,33.3 39.98,34.19 39.98,39.67 38.56,41.1 37.04,41.1 OK6.4 | OK9.4 36.28,18.22 | OK9.4 36.87,18.64 39.01,18.64 39.98,19.61 39.98,24.79 38.84,25.93 38.73,25.93 | X1.6 4.39,53.66 8.19,53.66 8.33,53.8 | 8.33,38.15 8.33,18.22 | X1.3 4.45,38.15 8.33,38.15 | OK10.4 55.21,41.1 56.69,41.1 58.12,39.67 58.12,34.44 57.46,33.79 OK11.4 58.12,33.79 58.12,27.58 56.42,25.89 | OK15.4 83.98,46.68 84.89,45.77 84.89,38.91 | 84.89,38.91 84.89,32.31 | 84.89,32.31 84.89,25.55 83.52,24.18 81.23,24.18 OK18.4 | OK17.4 84.55,31.98 84.89,32.31 | OK16.4 84.27,39.53 84.89,38.91 | 8.33,38.15 8.33,53.8 | 8.33,53.8 8.33,68.33 | 8.33,68.33 8.33,79.65 | X2.2 8.33,80.41 8.33,79.65 | X1.9 8.22,68.44 8.33,68.33 | 8.33,79.65 10.01,77.98 22.71,77.98 | 22.71,77.98 37.74,77.98 | 37.74,77.98 52.63,77.98 | 52.63,77.98 67.77,77.98 | 67.77,77.98 81.38,77.98 82.96,79.55 82.96,80.86 X3.7 | X3.4 67.77,77.98 | X3.1 52.76,78.11 52.63,77.98 | X2.8 37.72,78.01 37.74,77.98 | X2.5 22.73,78 22.71,77.98
  Top 1.422: OK14.4 66.56,24.07 66.32,23.82 58.06,23.82 57.71,24.18
  Top 1.524: OK14.4 71.3,21.08 79.05,21.08 81.2,23.24 OK18.4 | X6.1 4.35,18.22 8.33,18.22 16.51,18.22 17.27,18.22
  Top 1.676: 17.27,18.22 17.35,18.22 19.86,20.73 19.86,24.62 OK1.4 21.56,24.66 22.35,25.45 22.35,32.11 | 36.28,18.22 16.51,18.22 | 22.35,32.11 22.35,39.17 | 22.35,39.17 22.35,47.04 | 22.35,47.04 22.35,53.14 21.54,53.95 20.19,53.95 OK5.4 | OK2.4 22.24,32.22 22.35,32.11 | OK3.4 22.17,39.34 22.35,39.17 | OK4.4 22.17,46.86 22.35,47.04
  Bottom 1.27: 55.15,26.31 OK12.4 56.09,26.22 | 6.32,53.43 X1.6
VIN
  Bottom 1.27: X4.4 18.09,3.99 18.09,10.16 24.28,16.36 51.26,16.36 52.67,14.95 POWER.8

### Text on the board
tPlace: V1.0 | 10 | 8 | 2 | 1 | 0 | 16 | 17 | 18 | 19 | 20 | 21 | 13 | 12 | 11 | 9 | 7 | 6 | 5 | 4 | 3 | 14 | 15 | Vext | 10 | 0 | 1 | 2 | 3 | 4 | 5 | 6 | 7 | 8 | 9 | 11 | 12 | 13 | 14 | 15 | 3v3 | 5v | GND | Vin | A0 | A1 | A2 | A3 | A4
tNames: REMOVE FOR / FLASHING